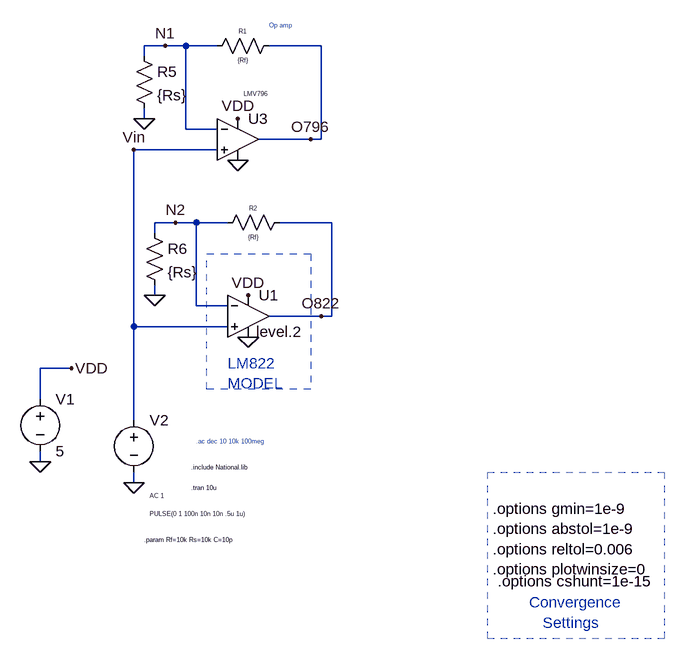
[diagram p0: schematic OpAmpTestTimeDomain.asc]
OpAmpTestTimeDomain.asc, the LTspice schematic file:
Version 4
SHEET 1 1144 680
WIRE 48 -736 16 -736
WIRE 80 -736 48 -736
WIRE 128 -736 80 -736
WIRE 288 -736 208 -736
WIRE 16 -720 16 -736
WIRE 16 -624 16 -640
WIRE 80 -608 80 -736
WIRE 128 -608 80 -608
WIRE 272 -592 192 -592
WIRE 288 -592 288 -736
WIRE 288 -592 272 -592
WIRE 128 -576 0 -576
WIRE 64 -464 32 -464
WIRE 96 -464 64 -464
WIRE 144 -464 96 -464
WIRE 304 -464 224 -464
WIRE 32 -448 32 -464
WIRE 32 -352 32 -368
WIRE 96 -336 96 -464
WIRE 144 -336 96 -336
WIRE 288 -320 208 -320
WIRE 304 -320 304 -464
WIRE 304 -320 288 -320
WIRE 0 -304 0 -576
WIRE 144 -304 0 -304
WIRE -96 -240 -144 -240
WIRE -144 -192 -144 -240
WIRE 0 -160 0 -304
WIRE -144 -96 -144 -112
WIRE 0 -64 0 -80
FLAG -144 -96 0
FLAG 0 -64 0
FLAG -96 -240 VDD
FLAG 176 -352 VDD
FLAG 176 -288 0
FLAG 272 -592 O796
FLAG 288 -320 O822
FLAG 32 -352 0
FLAG 160 -624 VDD
FLAG 160 -560 0
FLAG 16 -624 0
FLAG 0 -576 Vin
FLAG 48 -736 N1
FLAG 64 -464 N2
SYMBOL voltage -144 -208 R0
WINDOW 123 0 0 Left 0
WINDOW 39 0 0 Left 0
SYMATTR InstName V1
SYMATTR Value 5
SYMBOL voltage 0 -176 R0
WINDOW 3 24 160 Left 0
WINDOW 123 24 132 Left 0
WINDOW 39 0 0 Left 0
SYMATTR Value PULSE(0 1 100n 10n 10n .5u 1u)
SYMATTR Value2 AC 1
SYMATTR InstName V2
SYMBOL res 128 -448 R270
WINDOW 0 32 56 VTop 0
WINDOW 3 0 56 VBottom 0
SYMATTR InstName R2
SYMATTR Value {Rf}
SYMBOL Opamps\\opamp2 160 -656 R0
WINDOW 3 9 -6 Left 0
SYMATTR Value LMV796
SYMATTR InstName U3
SYMBOL res 112 -720 R270
WINDOW 0 32 56 VTop 0
WINDOW 3 0 56 VBottom 0
SYMATTR InstName R1
SYMATTR Value {Rf}
SYMBOL res 0 -736 R0
SYMATTR InstName R5
SYMATTR Value {Rs}
SYMBOL res 16 -464 R0
SYMATTR InstName R6
SYMATTR Value {Rs}
SYMBOL opamps\\UniversalOpamp2 176 -320 R0
WINDOW 38 12 24 Left 2
SYMATTR InstName U1
SYMATTR Value2 Avol=100K GBW=5.6Meg Slew=2Meg
SYMATTR SpiceLine ilimit=40m rail=0 Vos=3.5m phimargin=45
SYMATTR SpiceLine2 en=24n enk=100 in=0.25p ink=100 Rin=12Meg
TEXT 96 -128 Left 0 ;.ac dec 10 10k 100meg
TEXT 208 -768 Left 0 ;Op amp
TEXT 88 -88 Left 0 !.include National.lib
TEXT 88 -56 Left 0 !.tran 10u
TEXT 16 24 Left 0 !.param Rf=10k Rs=10k C=10p
TEXT 552 -24 Left 2 !.options gmin=1e-9\n.options abstol=1e-9\n.options reltol=0.006\n.options plotwinsize=0
TEXT 560 88 Left 2 !.options cshunt=1e-15
TEXT 608 120 Left 2 ;Convergence\n   Settings
TEXT 144 -248 Left 2 ;LM822\nMODEL
RECTANGLE Normal 816 176 544 -80 1
RECTANGLE Normal 272 -208 112 -416 2

The netlist it stands for:
* OpAmpTestTimeDomain.asc
V1 VDD 0 5
V2 Vin 0 PULSE(0 1 100n 10n 10n .5u 1u) AC 1
R2 N2 O822 {Rf}
XU3 Vin N1 VDD 0 O796 LMV796  ; pins In+ In- V+ V- OUT
R1 N1 O796 {Rf}
R5 N1 0 {Rs}
R6 N2 0 {Rs}
XU1 Vin N2 VDD 0 O822 level.2 Avol=100K GBW=5.6Meg Slew=2Meg ilimit=40m rail=0 Vos=3.5m phimargin=45 en=24n enk=100 in=0.25p ink=100 Rin=12Meg  ; pins IN+ IN- V+ V- OUT
* .ac dec 10 10k 100meg
* Op amp
.include National.lib
.tran 10u
.param Rf=10k Rs=10k C=10p
.options gmin=1e-9
.options abstol=1e-9
.options reltol=0.006
.options plotwinsize=0
.options cshunt=1e-15
* Convergence
*    Settings
* LM822
* MODEL
.lib UniversalOpamps2.sub
.backanno
.end